# EAGLE design 555 Synthesizer (EAGLE 7.4.0)
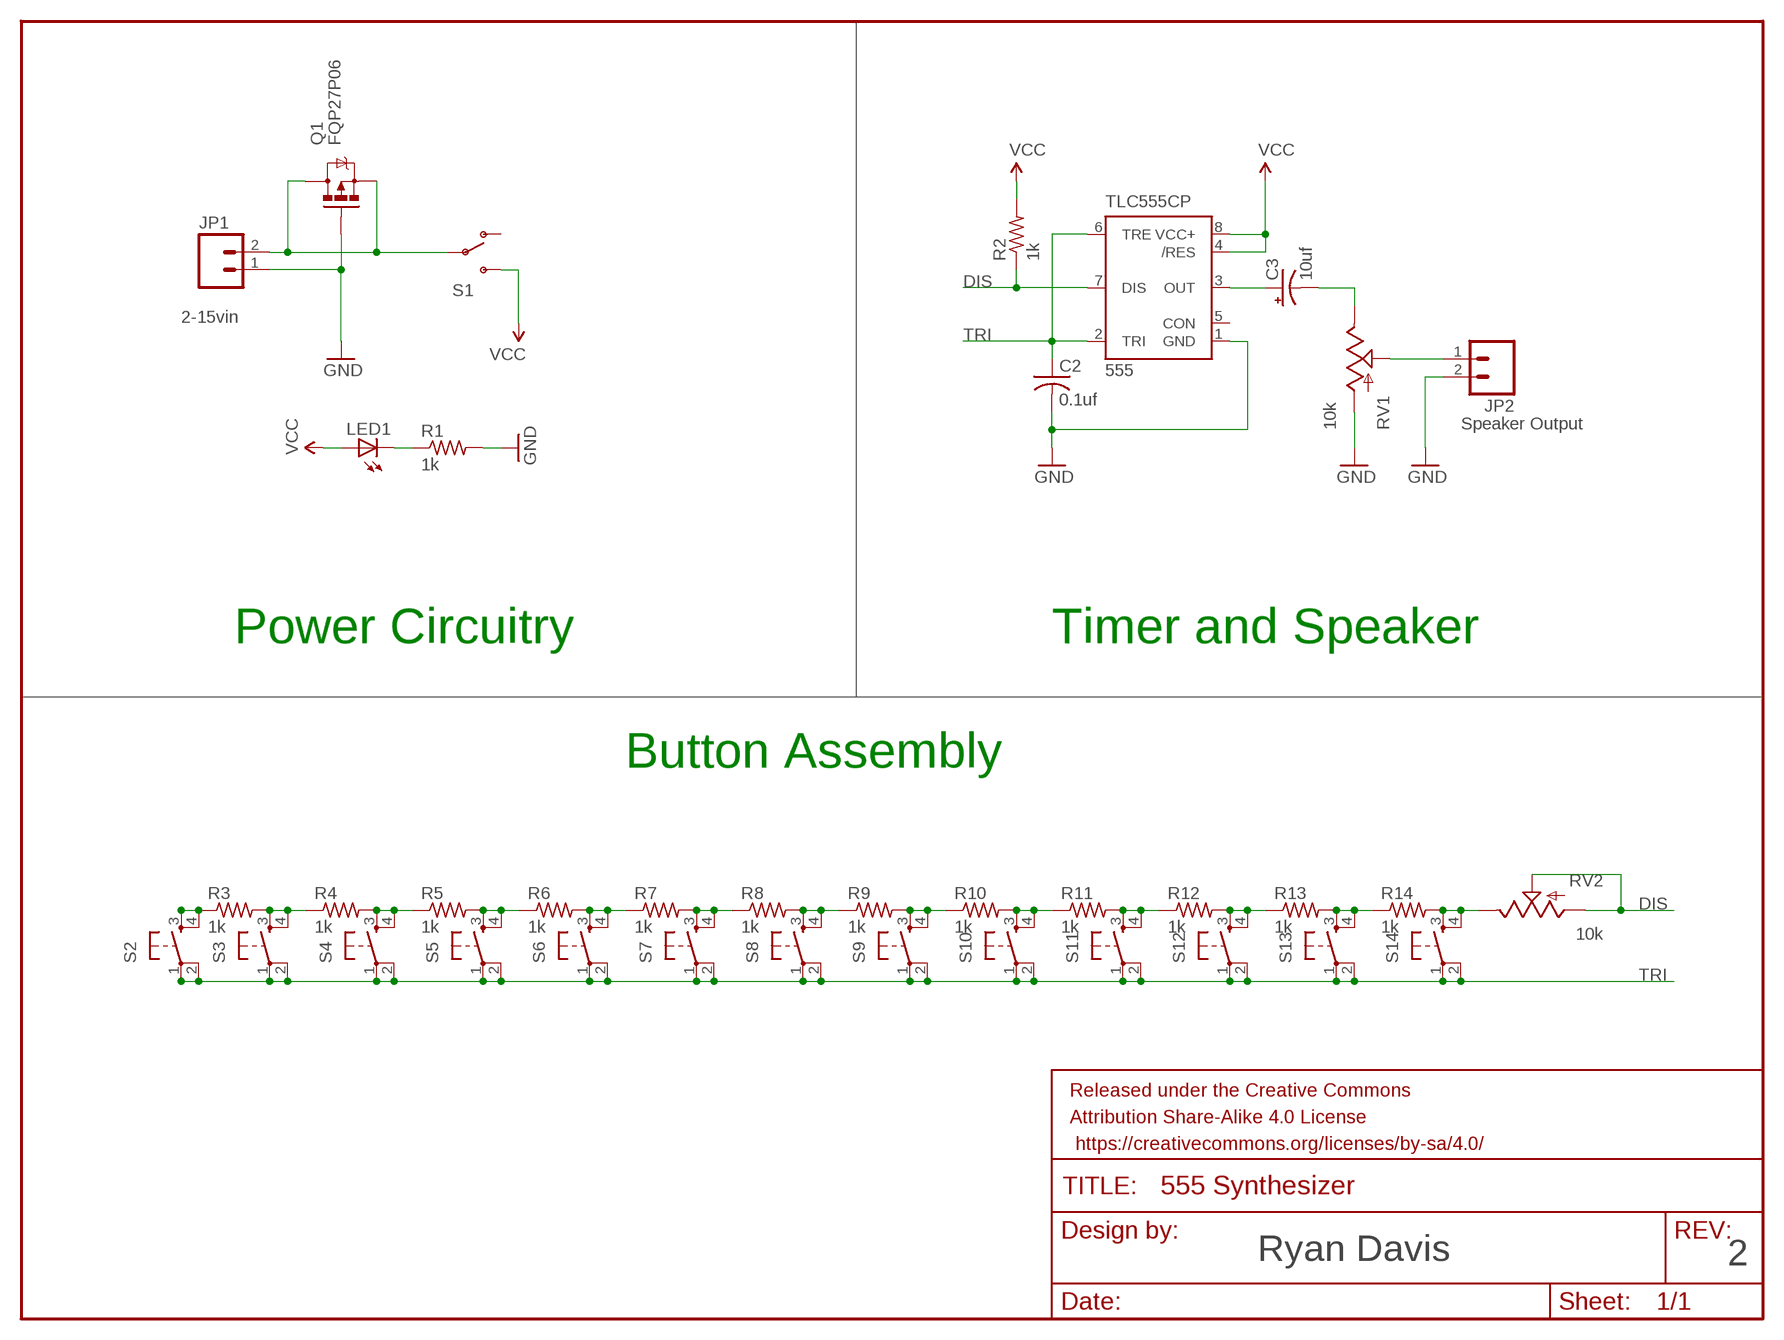
[diagram p0: schematic, sheet 1]

## Parts
C2  0.1uf  C-US025-025X050  [C025-025X050]
C3  10uf  CPOL-USE2,5-6E  [E2,5-6E]
FRAME1  FRAME-LETTERNO_PACKAGE  [DUMMY]
JP1  M023.5MM  [SCREWTERMINAL-3.5MM-2]
JP2  M023.5MM  [SCREWTERMINAL-3.5MM-2]
LED1  LED5MM  [LED5MM]
Q1  FQP27P06  MOSFET-PCHANNELFQP27P06  [TO220V]
R1  1k  R-US_0204/7  [0204/7]
R2  1k  R-US_0204/7  [0204/7]
R3  1k  R-US_0204/7  [0204/7]
R4  1k  R-US_0204/7  [0204/7]
R5  1k  R-US_0204/7  [0204/7]
R6  1k  R-US_0204/7  [0204/7]
R7  1k  R-US_0204/7  [0204/7]
R8  1k  R-US_0204/7  [0204/7]
R9  1k  R-US_0204/7  [0204/7]
R10  1k  R-US_0204/7  [0204/7]
R11  1k  R-US_0204/7  [0204/7]
R12  1k  R-US_0204/7  [0204/7]
R13  1k  R-US_0204/7  [0204/7]
R14  1k  R-US_0204/7  [0204/7]
RV1  10k  POTALPS-KIT  [ALPS_POT_KIT]
RV2  10k  POTALPS-KIT  [ALPS_POT_KIT]
S1  SWITCH-SPDTKIT  [SWITCH-SPDT_KIT]
S2  TAC_SWITCHPTH  [TACTILE-PTH]
S3  TAC_SWITCHPTH  [TACTILE-PTH]
S4  TAC_SWITCHPTH  [TACTILE-PTH]
S5  TAC_SWITCHPTH  [TACTILE-PTH]
S6  TAC_SWITCHPTH  [TACTILE-PTH]
S7  TAC_SWITCHPTH  [TACTILE-PTH]
S8  TAC_SWITCHPTH  [TACTILE-PTH]
S9  TAC_SWITCHPTH  [TACTILE-PTH]
S10  TAC_SWITCHPTH  [TACTILE-PTH]
S11  TAC_SWITCHPTH  [TACTILE-PTH]
S12  TAC_SWITCHPTH  [TACTILE-PTH]
S13  TAC_SWITCHPTH  [TACTILE-PTH]
S14  TAC_SWITCHPTH  [TACTILE-PTH]
TLC555CP  555  NE555KIT  [DIP08-KIT]

## Nets
DIS: R2.1 RV2.P$2(S) RV2.P$3(A) TLC555CP.7(DIS)
GND: C2.2 JP1.1 JP2.2 Q1.1(G) R1.2 RV1.P$3(A) TLC555CP.1(GND)
N$1: JP1.2 Q1.2(D) Q1.3(S) S1.2(P)
N$4: LED1.K(C) R1.1
N$6: C3.+ TLC555CP.3(OUT)
N$7: C3.- RV1.P$1(E)
N$8: JP2.1 RV1.P$2(S)
N$9: R3.1 S2.3 S2.4
N$10: R3.2 R4.1 S3.3 S3.4
N$11: R4.2 R5.1 S4.3 S4.4
N$12: R5.2 R6.1 S5.3 S5.4
N$13: R6.2 R7.1 S6.3 S6.4
N$14: R7.2 R8.1 S7.3 S7.4
N$15: R8.2 R9.1 S8.3 S8.4
N$16: R9.2 R10.1 S9.3 S9.4
N$17: R10.2 R11.1 S10.3 S10.4
N$18: R11.2 R12.1 S11.3 S11.4
N$19: R12.2 R13.1 S12.3 S12.4
N$20: R13.2 R14.1 S13.3 S13.4
N$21: R14.2 RV2.P$1(E) S14.3 S14.4
TRI: C2.1 S2.1 S2.2 S3.1 S3.2 S4.1 S4.2 S5.1 S5.2 S6.1 S6.2 S7.1 S7.2 S8.1 S8.2 S9.1 S9.2 S10.1 S10.2 S11.1 S11.2 S12.1 S12.2 S13.1 S13.2 S14.1 S14.2 TLC555CP.2(TRI) TLC555CP.6(TRE)
VCC: LED1.A R2.2 S1.3(S) TLC555CP.4(/RES) TLC555CP.8(VCC+)
Unconnected: S1.1(O) TLC555CP.5(CON)

## Notes on the sheet
- 2-15vin
- Speaker Output
- Power Circuitry | Timer and Speaker
- Button Assembly
- Ryan Davis
- 2

## Library data of the parts
C2 = adafruit:C-US: CAPACITOR, American symbol
C3 = adafruit:CPOL-US: POLARIZED CAPACITOR, American symbol
FRAME1 = SparkFun-Aesthetics:FRAME-LETTER: Schematic Frame Standard 8.5x11 US Letter frame; DESIGNER: Nobody; VERSION: v01
JP1 JP2 = SparkFun-Connectors:M02: Standard 2-pin 0.1" header. Use with - straight break away headers ( PRT-00116) - right angle break away headers (PRT-00553) - swiss pins (PRT-00743) - machine pins (PRT-00117) - female headers (PRT-00115) Molex polarized connector foot print use with: PRT-08233 with associated crimp pins and housings. 2.54_SCREWTERM for use with PRT-10571. 3.5mm Screw Terminal footprints for PRT-08084 5mm Screw Terminal footprints for use with PRT-08432; PROD_ID: CONN-08399
LED1 = adafruit:LED: LED OSRAM: - CHIPLED LG R971, LG N971, LY N971, LG Q971, LY Q971, LO R971, LY R971 LH N974, LH R974 LS Q976, LO Q976, LY Q976 LO Q996 - Hyper CHIPLED LW Q18S LB Q993, LB Q99A, LB R99A - SideLED LS A670, LO A670, LY A670, LG A670, LP A670 LB A673, LV A673, LT A673, LW A673 LH A674 LY A675 LS A676, LA A676, LO A676, LY A676, LW A676 LS A679, LY A679, LG A679 - Hyper Micro SIDELED® LS Y876, LA Y876, LO Y876, LY Y876 LT Y87S - SmartLED LW L88C, LW L88S LB L89C, LB L89S, LG L890 LS L89K, LO L89K, LY L89K LS L896, LA L896, LO L896, LY L896 - TOPLED LS T670, LO T670, LY T670, LG T670, LP T670 LSG T670, LSP T670, LSY T670, LOP T670, LYG T670 LG T671, LOG T671, LSG T671 LB T673, LV T673, LT T673, LW T673 LH T674 LS T676, LA T676, LO T676, LY T676, LB T676, LH T676, LSB T676, LW T676 LB T67C, LV T67C, LT T67C, LS T67K, LO T67K, LY T67K, LW E67C LS E67B, LA E67B, LO E67B, LY E67B, LB E67C, LV E67C, LT E67C LW T67C LS T679, LY T679, LG T679 LS T770, LO T770, LY T770, LG T770, LP T770 LB T773, LV T773, LT T773, LW T773 LH T774 LS E675, LA E675, LY E675, LS T675 LS T776, LA T776, LO T776, LY T776, LB T776 LHGB T686 LT T68C, LB T68C - Hyper Mini TOPLED® LB M676 - Mini TOPLED Santana® LG M470 LS M47K, LO M47K, LY M47K Source: http://www.osram.convergy.de/
Q1 = SparkFun-DiscreteSemi:MOSFET-PCHANNEL: Generic PMOSFET IRLML2244 - TRANS-11153 (SOT-23 -20V -4.3A) (1.Gate 2.Source 3.Drain) FQP27P06 - COM-10349 <http://www.sparkfun.com/products/10349> (TO-220 -60V -27A) (1.Gate 2.Source 3.Drain)
R1-R14 = adafruit:R-US_: RESISTOR, American symbol
RV1 RV2 = SparkFun-Electromechanical:POT; PROD_ID: RES-09177
S1 = SparkFun-Electromechanical:SWITCH-SPDT: SPDT Switch Simple slide switch, Spark Fun Electronics SKU : COM-00102 DPDT SMT slide switch, AYZ0202, SWCH-08179; PROD_ID: SWCH-08261
S2-S14 = SparkFun-Retired:TAC_SWITCH: Momentary Switch Button commonly used for reset or general input. Spark Fun Electronics SKU : COM-00097 SMT- SWCH-08247
TLC555CP = SparkFun-AnalogIC:NE555: General purpose bipolar Timer; PROD_ID: IC-11930

## Board
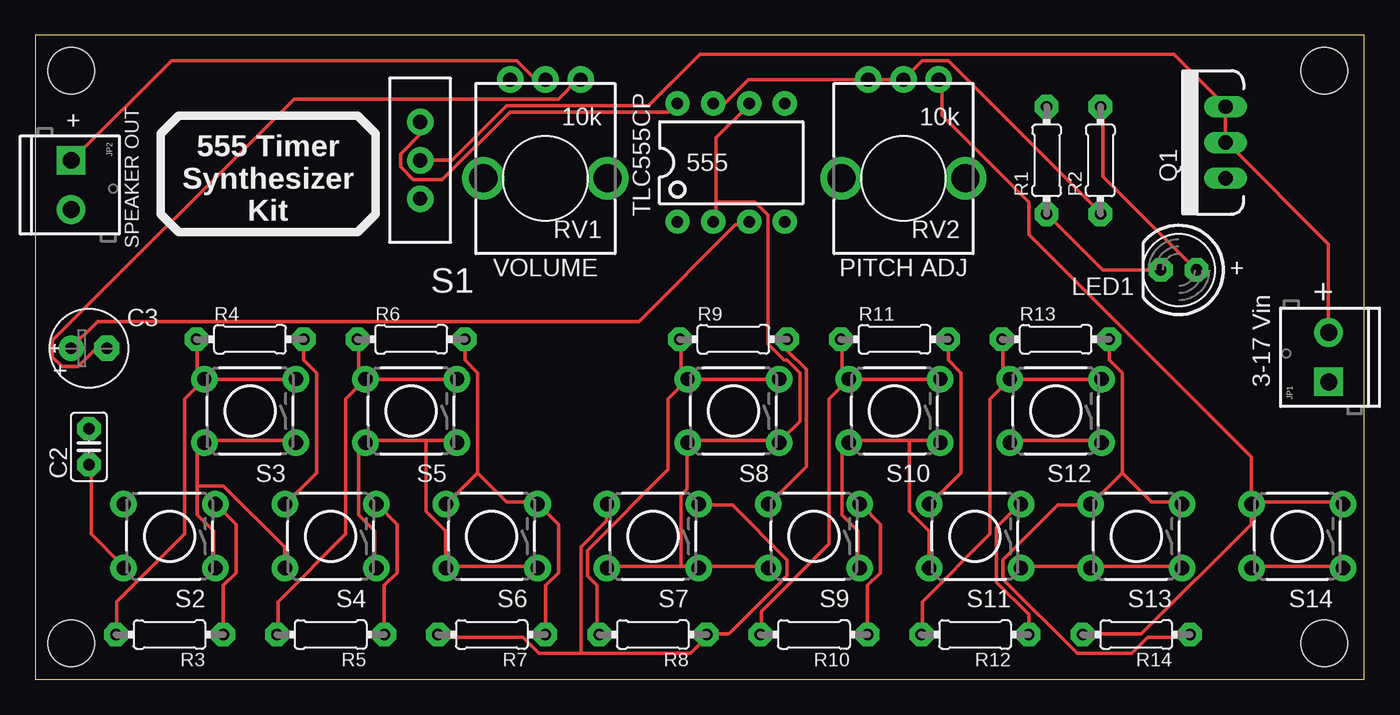
[diagram p1: board, top side]
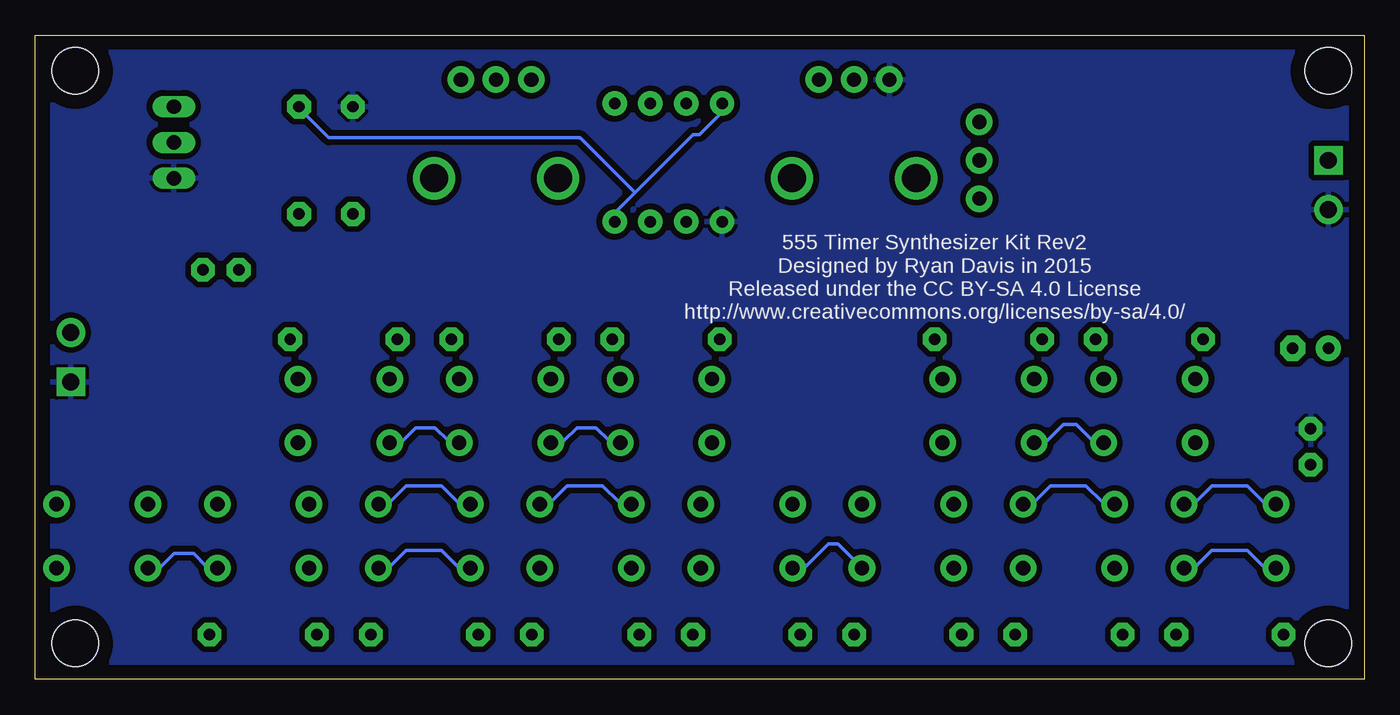
[diagram p2: board, bottom side, seen from below]

Size 94.28 x 45.71 mm. Coordinates in mm from the lower left corner, seen from the top.
Outline: 0,0 94.28,0 94.28,45.71 0,45.71 0,0
Copper layers (1*16): Top 0.035mm / dielectric 1.5mm / Bottom 0.035mm
Design rules "default": minimum track width 10mil, minimum drill 24mil, track to track 8mil, track to pad 8mil, pad to pad 8mil, via to via 8mil, smd to smd 8mil, copper to edge 40mil, drill to drill 8mil, minimum pad ring 10mil, minimum via ring 8mil, stop-mask expansion 4mil, vias tented up to drill 0mil, thermal gap 10mil

### Footprints (pad centres in the part's own frame; a part is rotated, then mirrored left to right if it is on the bottom)
C025-025X050 = drill 0.813 pad 1.676 octagon: 1 -1.27,0; 2 1.27,0
E2,5-6E = drill 0.813 pad 1.778: + -1.27,0 | drill 0.813 pad 1.778 octagon: - 1.27,0
SCREWTERMINAL-3.5MM-2 = drill 1.2 pad 2.032 square: 1 0,0 | drill 1.2 pad 2.032: 2 3.5,0
LED5MM = drill 0.813 pad 1.676 octagon: A -1.27,0; K 1.27,0
TO220V = drill 1.016 long: 1 -2.54,0; 2 0,0; 3 2.54,0
0204/7 = drill 0.813 pad 1.676 octagon: 1 -3.81,0; 2 3.81,0
ALPS_POT_KIT = drill 1 pad 1.88: P$1 7,-2.5; P$2 7,0; P$3 7,2.5 | drill 2: P$4 0,-4.4; P$5 0,4.4
SWITCH-SPDT_KIT = drill 1.016 pad 1.88: 1 0,2.718; 2 0,0; 3 0,-2.718
TACTILE-PTH = drill 1.016 pad 1.88: 1 -3.251,2.261; 2 3.251,2.261; 3 -3.251,-2.261; 4 3.251,-2.261
DIP08-KIT = drill 0.813 pad 1.727: 1 -3.81,-4.191; 2 -1.27,-4.191; 3 1.27,-4.191; 4 3.81,-4.191; 5 3.81,4.191; 6 1.27,4.191; 7 -1.27,4.191; 8 -3.81,4.191
STAND-OFF = hole 3.302: 0,0

### Placement (x,y rotation side)
C2  3.81,16.51 90 top
C3  3.81,23.49 0 top
FRAME1  0.64,-1.27 0 top
JP1  91.76,21.11 90 top
JP2  2.54,36.83 270 top
LED1  81.12,29.05 180 top
Q1  84.45,38.1 90 top
R1  71.75,36.83 90 top
R2  75.56,36.83 90 top
R3  9.53,3.17 180 top
R4  15.24,24.13 0 top
R5  20.96,3.17 180 top
R6  26.67,24.13 0 top
R7  32.38,3.17 180 top
R8  43.81,3.17 180 top
R9  49.53,24.13 0 top
R10  55.25,3.17 180 top
R11  60.96,24.13 0 top
R12  66.67,3.17 180 top
R13  72.39,24.13 0 top
R14  78.11,3.17 180 top
RV1  36.2,35.56 90 top
RV2  61.59,35.56 90 top
S1  27.3,36.83 180 top
S2  9.53,10.16 180 top
S3  15.24,19.05 180 top
S4  20.96,10.16 180 top
S5  26.67,19.05 180 top
S6  32.38,10.16 180 top
S7  43.81,10.16 180 top
S8  49.53,19.05 180 top
S9  55.25,10.16 180 top
S10  60.96,19.05 180 top
S11  66.67,10.16 180 top
S12  72.39,19.05 180 top
S13  78.11,10.16 180 top
S14  89.53,10.16 180 top
TLC555CP  49.37,36.67 0 top
U$1  [STAND-OFF]  91.44,43.18 0 top
U$2  [STAND-OFF]  2.54,43.18 0 top
U$3  [STAND-OFF]  2.54,2.54 0 top
U$4  [STAND-OFF]  91.44,2.54 0 top

### Tracks (layer width: path | path; a pad name or v marks a point on that pad's centre or on a via)
DIS
  Top 0.254: TLC555CP.7 48.31,40.95 49,40.95 50.6,42.55 59.05,42.55 RV2.P$3 59.28,42.55 61.57,42.55 RV2.P$2 61.8,42.77 62.94,43.92 64.77,43.92 75.51,33.17 R2.1
GND
  pour Bottom (isolate 0.406): 1.27,0.64 93.34,0.64 93.34,45.09 1.27,45.09
N$1
  Top 0.254: S1.2 29.57,36.83 33.45,40.72 43.51,40.72 47.17,44.37 80.77,44.37 84.43,40.72 Q1.3 84.43,40.49 84.43,38.2 Q1.2 84.66,37.97 91.75,30.89 91.75,24.71 JP1.2
N$4
  Top 0.254: LED1.K 79.63,29.06 75.74,29.06 71.86,32.94 R1.1
N$6
  Top 0.254: TLC555CP.3 50.6,32.26 49.68,32.26 42.82,25.4 4.42,25.4 2.59,23.57 C3.+
N$7
  Top 0.254: C3.- 4.88,23.34 4.19,23.34 3.05,22.2 1.91,22.2 1.22,22.88 1.22,24.03 18.36,41.17 37.11,41.17 38.48,42.55 RV1.P$1
N$8
  Top 0.254: RV1.P$2 36.2,42.77 35.28,42.77 34.14,43.92 9.68,43.92 2.59,36.83 JP2.1
N$9
  Top 0.254: R3.1 13.33,6.66 14.25,7.57 14.25,11 12.88,12.37 S2.3
  Bottom 0.254: S2.4 6.48,12.6 7.16,12.6 8.31,13.74 10.82,13.74 11.96,12.6 12.65,12.6 S2.3
N$10
  Top 0.254: S3.4 10.59,19.91 10.59,10.31 5.79,5.51 5.79,3.23 R3.2 | R4.1 11.51,24.03 11.51,21.97 11.96,21.51 S3.4 | S3.3 18.36,21.29 12.19,21.29 S3.4
N$11
  Top 0.254: R5.1 24.77,6.66 25.68,7.57 25.68,11 24.31,12.37 S4.3 | R4.2 19.05,22.66 19.96,21.74 19.96,14.66 17.91,12.6 S4.4
  Bottom 0.254: S4.3 24.08,12.6 23.39,12.6 22.25,13.74 19.74,13.74 18.59,12.6 17.91,12.6 S4.4
N$12
  Top 0.254: S5.4 22.02,19.91 22.02,10.31 17.22,5.51 17.22,3.23 R5.2 | R6.1 22.94,24.03 22.94,21.97 23.39,21.51 S5.4 | S5.3 29.79,21.29 23.62,21.29 S5.4
N$13
  Top 0.254: R7.1 36.2,6.66 37.11,7.57 37.11,11 35.74,12.37 S6.3 35.51,12.6 33.45,12.6 31.39,14.66 | R6.2 30.48,22.66 31.39,21.74 31.39,14.66 | 31.39,14.66 29.34,12.6 S6.4
N$14
  Top 0.254: 38.71,1.85 46.48,1.85 47.62,3 R8.1 47.62,3.23 49.23,3.23 53.34,7.34 53.34,8.48 49.45,12.37 47.17,12.37 S7.3 | 38.71,1.85 35.74,1.85 34.59,3 28.65,3 R7.2 | 38.71,1.85 38.71,9.4 40.54,11.23 40.54,12.37 S7.4
N$15
  Top 0.254: S8.4 44.88,19.91 44.88,14.88 39.17,9.17 39.17,7.34 39.85,6.66 39.85,3.23 R8.2 | R9.1 45.8,24.03 45.8,21.97 46.25,21.51 S8.4 | S8.3 52.65,21.29 46.48,21.29 S8.4
N$16
  Top 0.254: R10.1 59.05,6.66 59.97,7.57 59.97,11 58.6,12.37 S9.3 | R9.2 53.34,23.34 54.71,21.97 54.71,15.11 52.2,12.6 S9.4
  Bottom 0.254: S9.3 58.37,12.6 57.68,12.6 56.54,13.74 54.03,13.74 52.88,12.6 52.2,12.6 S9.4
N$17
  Top 0.254: S10.4 56.31,19.91 56.31,9.63 51.51,4.83 51.51,3.23 R10.2 | R11.1 57.23,24.03 57.23,21.97 57.68,21.51 S10.4 | S10.3 64.08,21.29 57.91,21.29 S10.4
N$18
  Top 0.254: R12.1 70.48,4.6 68.2,6.88 68.2,10.77 69.8,12.37 S11.3 | R11.2 64.77,22.66 65.68,21.74 65.68,14.66 63.63,12.6 S11.4
  Bottom 0.254: S11.3 69.8,12.6 69.11,12.6 67.97,13.74 65.46,13.74 64.31,12.6 63.63,12.6 S11.4
N$19
  Top 0.254: S12.4 67.74,19.91 67.74,10.31 62.94,5.51 62.94,3.23 R12.2 | R13.1 68.66,24.03 68.66,21.97 69.11,21.51 S12.4 | S12.3 75.51,21.29 69.34,21.29 S12.4
N$20
  Top 0.254: R13.2 76.2,22.66 77.11,21.74 77.11,14.66 | 77.11,14.66 75.06,12.6 S13.4 74.83,12.37 72.54,12.37 68.66,8.48 68.66,7.11 73.91,1.85 77.8,1.85 78.94,3 81.92,3 R14.1 | 77.11,14.66 79.17,12.6 81.23,12.6 S13.3
N$21
  Top 0.254: R14.2 74.37,3.23 78.49,3.23 86.26,11 86.26,12.37 S14.4 | S14.3 92.66,12.6 86.49,12.6 S14.4 | RV2.P$1 64.31,42.55 64.31,40.03 70.48,33.86 70.48,31.57 86.26,15.8 86.26,12.6 S14.4
TRI
  Top 0.254: S14.2 86.49,8.03 92.66,8.03 S14.1 | S11.1 70.03,8.03 74.83,8.03 S13.2 75.06,8.03 81.23,8.03 S13.1 | S12.2 69.34,16.94 75.51,16.94 S12.1 | 62.03,16.94 64.08,16.94 S10.1 | 62.03,16.94 57.91,16.94 S10.2 57.68,16.71 57.23,16.26 57.23,11.68 58.37,10.54 58.37,8.03 S9.1 | 62.03,16.94 62.03,11.91 63.4,10.54 63.4,8.03 S11.2 | C2.1 3.96,15.11 3.96,10.31 6.25,8.03 S2.2 | 11.51,13.74 11.51,16.26 11.96,16.71 S3.2 12.19,16.94 18.36,16.94 S3.1 | 11.51,13.74 11.51,11.68 12.65,10.54 12.65,8.03 S2.1 | 11.51,13.74 13.33,13.74 17.68,9.4 17.68,8.03 S4.2 | S6.1 35.51,8.03 29.34,8.03 S6.2 29.11,8.03 29.11,10.54 27.74,11.91 27.74,16.94 | S4.1 24.08,8.03 24.08,10.54 22.94,11.68 22.94,16.26 23.39,16.71 S5.2 23.62,16.94 27.74,16.94 | 27.74,16.94 29.79,16.94 S5.1 | 48.31,33.86 48.31,38.43 50.6,40.72 TLC555CP.6 | 48.31,33.86 48.31,32.49 TLC555CP.2 | 45.8,8.03 46.94,8.03 S7.1 47.17,8.03 51.97,8.03 S9.2 | 45.8,8.03 40.77,8.03 S7.2 | 45.8,8.03 45.8,13.06 46.25,13.51 46.25,16.71 S8.2 46.48,16.94 52.65,16.94 S8.1 52.88,16.94 54.25,18.31 54.25,21.74 53.34,22.66 53.11,22.66 51.97,23.8 51.97,32.94 51.05,33.86 48.31,33.86
  Bottom 0.254: S14.2 86.26,8.03 85.34,8.03 84.43,8.94 83.06,8.94 82.14,8.03 81.46,8.03 S13.1 | S12.2 69.11,16.94 68.2,16.94 67.28,17.86 65.91,17.86 65,16.94 64.31,16.94 S10.1 | S11.1 69.8,8.03 69.11,8.03 67.97,9.17 65.46,9.17 64.31,8.03 63.63,8.03 S11.2 | S2.2 6.48,8.03 7.16,8.03 8.31,9.17 10.82,9.17 11.96,8.03 12.65,8.03 S2.1 | S6.1 35.74,8.03 37.34,9.63 38.02,9.63 39.62,8.03 40.54,8.03 S7.2 | S3.1 18.59,16.94 19.28,16.94 20.42,18.09 21.34,18.09 22.48,16.94 23.39,16.94 S5.2 | S10.2 57.68,16.94 56.77,16.94 55.86,17.86 54.48,17.86 53.57,16.94 52.88,16.94 S8.1
VCC
  Top 0.254: R2.2 75.74,40.49 75.74,35.69 82.37,29.06 LED1.A | S1.3 27.28,39.34 27.28,38.66 25.91,37.29 25.91,36.37 26.82,35.46 28.88,35.46 33.68,40.26 44.88,40.26 45.34,40.72 TLC555CP.8
  Bottom 0.254: 51.74,34.54 47.62,38.66 47.17,38.66 45.57,40.26 45.57,40.72 TLC555CP.8 | 51.74,34.54 53.11,33.17 53.11,32.49 TLC555CP.4 | 51.74,34.54 55.63,38.43 73.46,38.43 75.51,40.49 R2.2

### Text on the board
tPlace: + | SPEAKER OUT | 555 Timer / Synthesizer / Kit | VOLUME | PITCH ADJ | + | 3-17 Vin | + | +
bPlace: 555 Timer Synthesizer Kit Rev2 / Designed by Ryan Davis in 2015 / Released under the CC BY-SA 4.0 License / http://www.creativecommons.org/licenses/by-sa/4.0/